# Altium schematic sheet Display-Port.SchDoc
size A3; DocumentNumber: 6; SheetNumber: 6; SheetTotal: 9; PageSetup: Record=PageOptions|CenterHorizontal=True|CenterVertical=True|PrintScale=0.97|XCorrection=1.00|YCorrection=1.00|PrintKind=1|BorderSize=5000000|LeftOffset=0|BottomOffset=0|Orientation=2|PaperLength=2970|PaperWidth=2100|Scale=100|PaperSource=7|PrintQuality=600|MediaType=1|DitherType=10|PaperKind=A4|PrintScaleMode=1
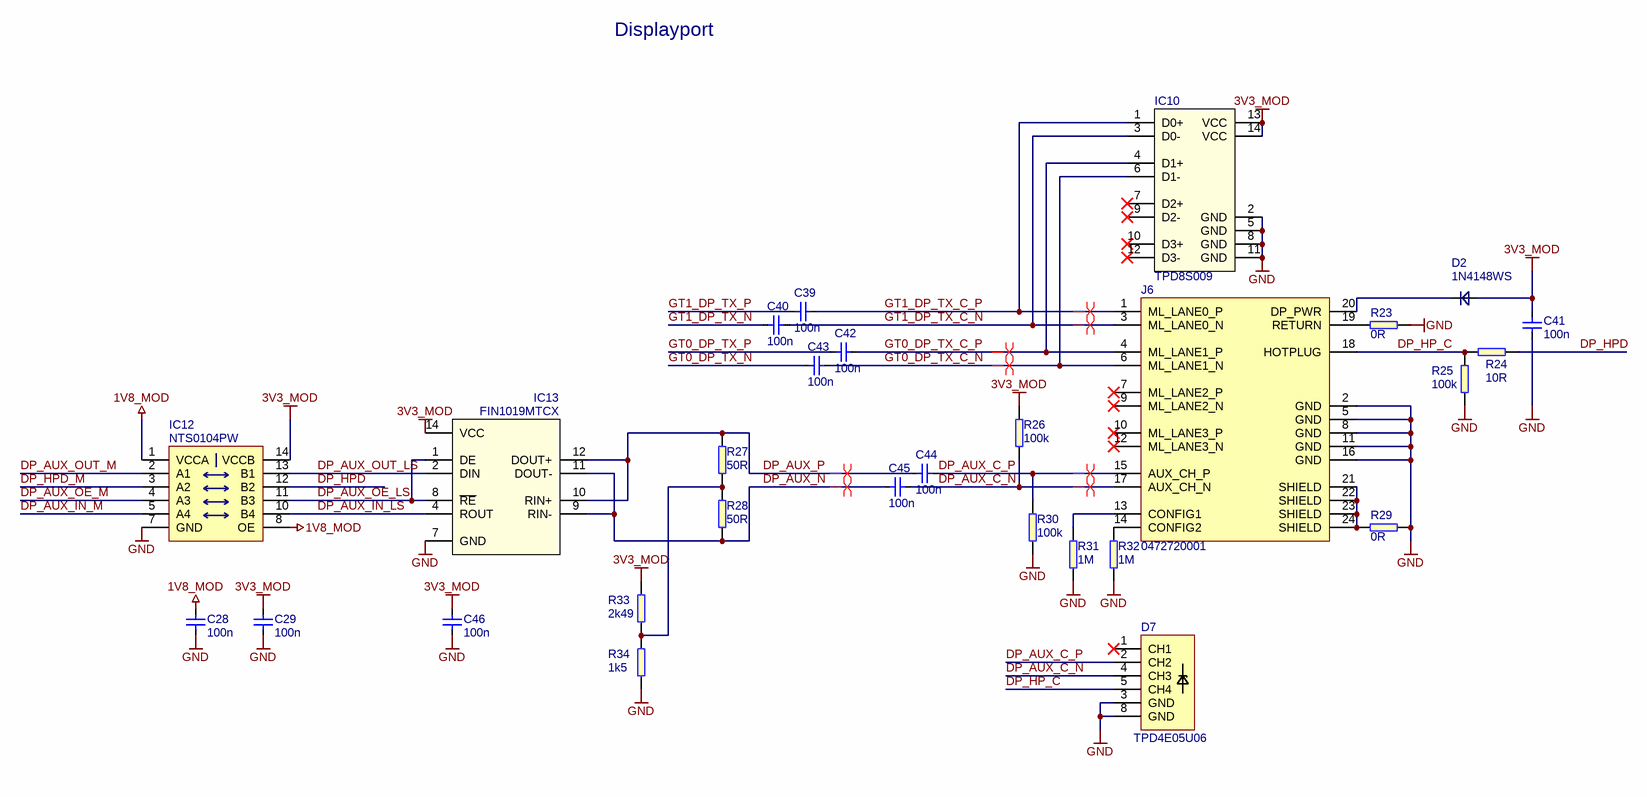
[diagram p0: Display-Port.SchDoc]

## Parts
C28  100n  [0603]
C29  100n  [0603]
C39  100n  [0603]
C40  100n  [0603]
C41  100n  [0603]
C42  100n  [0603]
C43  100n  [0603]
C44  100n  [0603]
C45  100n  [0603]
C46  100n  [0603]
D2  1N4148WS  [SOD-323]
D7  TPD4E05U06  [TPD4E05U06_PASS]
IC10  TPD8S009  [SON-15]
IC12  NTS0104PW  [TSSOP-14]
IC13  FIN1019MTCX  [TSSOP-14]
J6  0472720001
R23  0R  [0603]
R24  10R  [0603]
R25  100k  [0603]
R26  100k  [0603]
R27  50R  [0603]
R28  50R  [0603]
R29  0R  [0603]
R30  100k  [0603]
R31  1M  [0603]
R32  1M  [0603]
R33  2k49  [0603]
R34  1k5  [0603]

## Nets
1V8_MOD: C28.2 IC12.1(VCCA) IC12.8(OE)
3V3_MOD: C29.2 C41.1 C46.2 D2.A IC10.13(VCC) IC10.14(VCC) IC12.14(VCCB) IC13.14(VCC) R26.2 R33.2
GND: C28.1 C29.1 C41.2 C46.1 D7.3(GND) D7.8(GND) IC10.2(GND) IC10.5(GND) IC10.8(GND) IC10.11(GND) IC12.7(GND) IC13.7(GND) J6.2(GND) J6.5(GND) J6.8(GND) J6.11(GND) J6.16(GND) R23.2 R25.1 R29.2 R30.1 R31.1 R32.1 R34.1
DP_AUX_C_N: C45.2 D7.4(CH3) J6.17(AUX_CH_N) R26.1
DP_AUX_C_P: C44.2 D7.2(CH2) J6.15(AUX_CH_P) R30.2
DP_AUX_IN_LS: IC12.10(B4) IC13.4(ROUT)
DP_AUX_IN_M: IC12.5(A4)
DP_AUX_N: C45.1 IC13.9(RIN-) IC13.11(DOUT-) R28.1
DP_AUX_OE_LS: IC12.11(B3) IC13.1(DE) IC13.8(~{RE})
DP_AUX_OE_M: IC12.4(A3)
DP_AUX_OUT_LS: IC12.13(B1) IC13.2(DIN)
DP_AUX_OUT_M: IC12.2(A1)
DP_AUX_P: C44.1 IC13.10(RIN+) IC13.12(DOUT+) R27.2
DP_HP_C: D7.5(CH4) J6.18(HOTPLUG) R24.1 R25.2
DP_HPD: IC12.12(B2) R24.2
DP_HPD_M: IC12.3(A2)
GT0_DP_TX_C_N: C43.2 IC10.6(D1-) J6.6(ML_LANE1_N)
GT0_DP_TX_C_P: C42.2 IC10.4(D1+) J6.4(ML_LANE1_P)
GT0_DP_TX_N: C43.1
GT0_DP_TX_P: C42.1
GT1_DP_TX_C_N: C40.2 IC10.3(D0-) J6.3(ML_LANE0_N)
GT1_DP_TX_C_P: C39.2 IC10.1(D0+) J6.1(ML_LANE0_P)
GT1_DP_TX_N: C40.1
GT1_DP_TX_P: C39.1
NetD2_C: D2.C J6.20(DP_PWR)
NetJ6_13: J6.13(CONFIG1) R31.2
NetJ6_14: J6.14(CONFIG2) R32.2
NetJ6_19: J6.19(RETURN) R23.1
NetJ6_21: J6.21(SHIELD) J6.22(SHIELD) J6.23(SHIELD) J6.24(SHIELD) R29.1
NetR27_1: R27.1 R28.2 R33.1 R34.2

Not connected (* = marked no-connect by the designer): D7 1(CH1)*; IC10 7(D2+)* 9(D2-)* 10(D3+)* 12(D3-)*; J6 7(ML_LANE2_P)* 9(ML_LANE2_N)* 10(ML_LANE3_P)* 12(ML_LANE3_N)*

## Layout directives
differential pair: DP_AUX_C_N, DP_AUX_C_P, DP_AUX_N, DP_AUX_P, GT0_DP_TX_C_N, GT0_DP_TX_C_P, GT1_DP_TX_C_N, GT1_DP_TX_C_P

## Notes on the sheet
- Displayport
- Title:
- Size:
- Date:
- A3
- Revision:
- Page:
- of
- Antmicro Ltd.
- File:
- www.antmicro.com

## Library data of the parts
C28 C29 C39-C46 = C_100n_0603: MLCC SMT Capacitor 100nF 0603; Manufacturer: WALSIN; MPN: 0603B104K500CT; Value: 100n; Part Number: C_100n_0603
D2 = 1N4148WS: Diode small signal; Manufacturer: MULTICOMP; Part Number: 1N4148WS; Value: 1N4148WS; MPN: 1N4148WS
D7 = TPD4E05U06_PASS: ESD Suppressors 4-CH; Manufacturer: Texas Instruments; MPN: TPD4E05U06DQAR; Part Number: TPD4E05U06_PASS; Value: TPD4E05U06
IC10 = TPD8S009: 8-Channel ESD Protection for DisplayPort and HDMI; Manufacturer: TEXAS INSTRUMENTS; MPN: TPD8S009DSMR; Part Number: TPD8S009; Value: TPD8S009
IC12 = NTS0104PW: 4 bit voltage level translator; Manufacturer: NXP; Part Number: NTS0104PW; Value: NTS0104PW; MPN: NTS0104PW
IC13 = FIN1019MTCX: 3.3 V LVDS High Speed Differential Driver Receiver; Manufacturer: OM SEMICONDUCTOR; Part Number: FIN1019MTCX; Value: FIN1019MTCX; MPN: FIN1019MTCX
J6 = CON-Molex-047272-0001: Manufacturer: Molex; Value: 0472720001; MPN: 0472720001
R23 R29 = R_0R_0603: SMT Resistor 0R 0603; Manufacturer: BOURNS; MPN: CR0603-J/-000ELF; Value: 0R; Part Number: R_0R_0603
R24 = R_10R_0603: SMT Resistor 10R 0603; Manufacturer: MULTICOMP; MPN: MCWR06X10R0FTL; Value: 10R; Part Number: R_10R_0603
R25 = R_100k_0603: SMT Resistor 100k 0603; Manufacturer: BOURNS; MPN: CR0603-JW-104GLF; Value: 100k; Part Number: R_100k_0603
R26 R30 = R_100k_0603_1%: SMT Resistor 100k 0603 1%; Manufacturer: BOURNS; MPN: CR0603-FX-1003HLF; Value: 100k; Part Number: R_100k_0603_1%
R27 R28 = R_50R_0603_1%: SMT Resistor 50R 0603 1%; Manufacturer: VISHAY; MPN: CRCW060350R0FKEA; Value: 50R; Part Number: R_50R_0603_1%
R31 R32 = R_1M_0603: SMT Resistor 1M 0603; Manufacturer: BOURNS; MPN: CR0603-JW-105GLF; Value: 1M; Part Number: R_1M_0603
R33 = R_2k49_0603_1%: SMT Resistor 2k49 0603 1%; Manufacturer: Vishay; MPN: CRCW06032K49FKEA; Value: 2k49; Part Number: R_2k49_0603_1%
R34 = R_1k5_0603: SMT Resistor 1k5 0603; Manufacturer: TE CONNECTIVITY / NEOHM; MPN: CPF0603B1K5E1; Value: 1k5; Part Number: R_1k5_0603